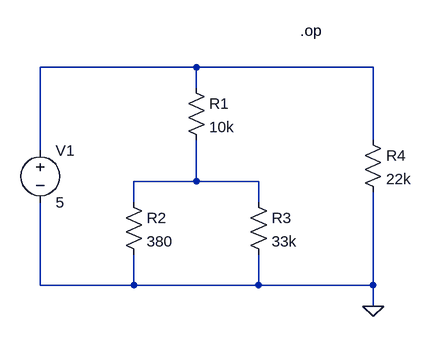
[diagram p0: schematic Ej 5 simulacion.asc]
Ej 5 simulacion.asc, the LTspice schematic file:
Version 4
SHEET 1 880 680
WIRE 160 48 -80 48
WIRE 432 48 160 48
WIRE 160 80 160 48
WIRE 432 160 432 48
WIRE -80 176 -80 48
WIRE 160 224 160 160
WIRE 160 224 64 224
WIRE 256 224 160 224
WIRE 64 256 64 224
WIRE 256 256 256 224
WIRE -80 384 -80 256
WIRE 64 384 64 336
WIRE 64 384 -80 384
WIRE 256 384 256 336
WIRE 256 384 64 384
WIRE 432 384 432 240
WIRE 432 384 256 384
WIRE 432 416 432 384
FLAG 432 416 0
DATAFLAG 160 64 "$-V(N002)"
DATAFLAG 432 96 ""
DATAFLAG 256 240 ""
DATAFLAG 64 240 ""
SYMBOL res 144 64 R0
SYMATTR InstName R1
SYMATTR Value 10k
SYMATTR SpiceLine tol=5
SYMBOL res 48 240 R0
SYMATTR InstName R2
SYMATTR Value 380
SYMATTR SpiceLine tol=5
SYMBOL res 240 240 R0
SYMATTR InstName R3
SYMATTR Value 33k
SYMATTR SpiceLine tol=5
SYMBOL res 416 144 R0
SYMATTR InstName R4
SYMATTR Value 22k
SYMATTR SpiceLine tol=5
SYMBOL voltage -80 160 R0
WINDOW 123 0 0 Left 0
WINDOW 39 0 0 Left 0
SYMATTR InstName V1
SYMATTR Value 5
TEXT 320 -8 Left 2 !.op

The netlist it stands for:
* Ej 5 simulacion.asc
R1 N001 N002 10k tol=5
R2 N002 0 380 tol=5
R3 N002 0 33k tol=5
R4 N001 0 22k tol=5
V1 N001 0 5
.op
.backanno
.end